# EAGLE design schematic_v2 (EAGLE 6.4)
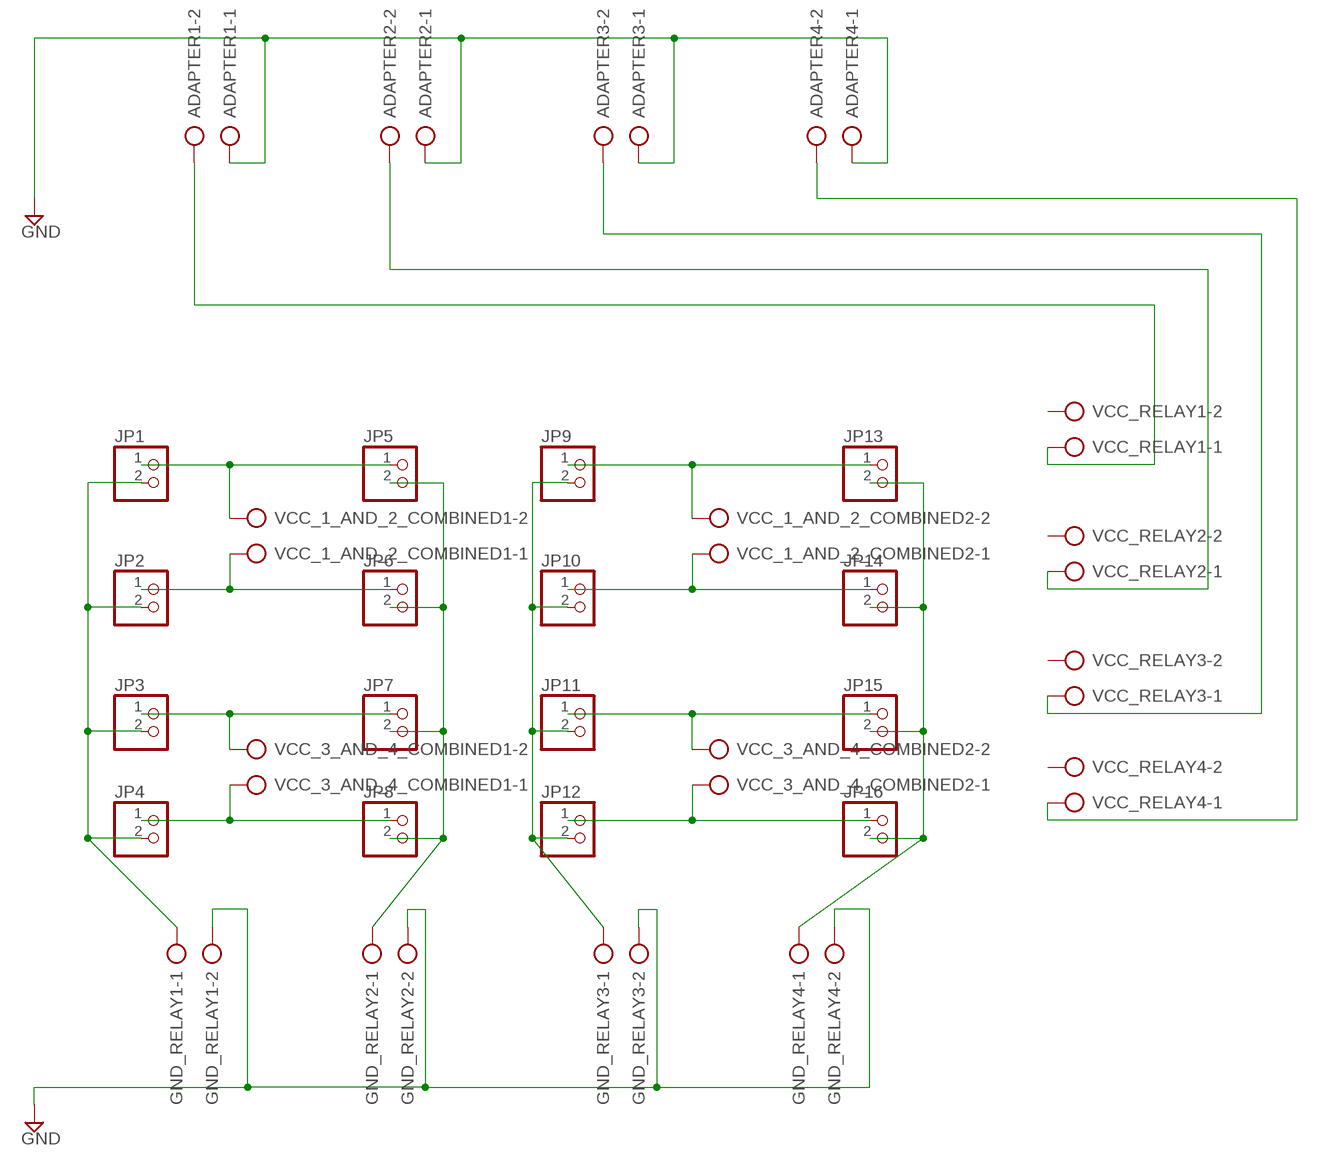
[diagram p0: schematic, sheet 1]

## Parts
ADAPTER1  AK300/2  [AK300/2]
ADAPTER2  AK300/2  [AK300/2]
ADAPTER3  AK300/2  [AK300/2]
ADAPTER4  AK300/2  [AK300/2]
GND_RELAY1  AK300/2  [AK300/2]
GND_RELAY2  AK300/2  [AK300/2]
GND_RELAY3  AK300/2  [AK300/2]
GND_RELAY4  AK300/2  [AK300/2]
JP1  PINHD-1X2  [1X02]
JP2  PINHD-1X2  [1X02]
JP3  PINHD-1X2  [1X02]
JP4  PINHD-1X2  [1X02]
JP5  PINHD-1X2  [1X02]
JP6  PINHD-1X2  [1X02]
JP7  PINHD-1X2  [1X02]
JP8  PINHD-1X2  [1X02]
JP9  PINHD-1X2  [1X02]
JP10  PINHD-1X2  [1X02]
JP11  PINHD-1X2  [1X02]
JP12  PINHD-1X2  [1X02]
JP13  PINHD-1X2  [1X02]
JP14  PINHD-1X2  [1X02]
JP15  PINHD-1X2  [1X02]
JP16  PINHD-1X2  [1X02]
VCC_1_AND_2_COMBINED1  AK300/2  [AK300/2]
VCC_1_AND_2_COMBINED2  AK300/2  [AK300/2]
VCC_3_AND_4_COMBINED1  AK300/2  [AK300/2]
VCC_3_AND_4_COMBINED2  AK300/2  [AK300/2]
VCC_RELAY1  AK300/2  [AK300/2]
VCC_RELAY2  AK300/2  [AK300/2]
VCC_RELAY3  AK300/2  [AK300/2]
VCC_RELAY4  AK300/2  [AK300/2]

## Nets
GND: ADAPTER1.1 ADAPTER2.1 ADAPTER3.1 ADAPTER4.1 GND_RELAY1.2 GND_RELAY2.2 GND_RELAY3.2 GND_RELAY4.2
N$1: JP1.1 JP5.1 VCC_1_AND_2_COMBINED1.2
N$2: JP2.1 JP6.1 VCC_1_AND_2_COMBINED1.1
N$3: JP3.1 JP7.1 VCC_3_AND_4_COMBINED1.2
N$4: JP4.1 JP8.1 VCC_3_AND_4_COMBINED1.1
N$5: ADAPTER1.2 VCC_RELAY1.1
N$6: ADAPTER4.2 VCC_RELAY4.1
N$7: GND_RELAY1.1 JP1.2 JP2.2 JP3.2 JP4.2
N$8: GND_RELAY2.1 JP5.2 JP6.2 JP7.2 JP8.2
N$9: GND_RELAY3.1 JP9.2 JP10.2 JP11.2 JP12.2
N$10: GND_RELAY4.1 JP13.2 JP14.2 JP15.2 JP16.2
N$11: ADAPTER3.2 VCC_RELAY3.1
N$12: ADAPTER2.2 VCC_RELAY2.1
N$13: JP9.1 JP13.1 VCC_1_AND_2_COMBINED2.2
N$14: JP10.1 JP14.1 VCC_1_AND_2_COMBINED2.1
N$15: JP11.1 JP15.1 VCC_3_AND_4_COMBINED2.2
N$16: JP12.1 JP16.1 VCC_3_AND_4_COMBINED2.1
Unconnected: VCC_RELAY1.2 VCC_RELAY2.2 VCC_RELAY3.2 VCC_RELAY4.2

## Library data of the parts
ADAPTER1-ADAPTER4 GND_RELAY1-GND_RELAY4 VCC_1_AND_2_COMBINED1 VCC_1_AND_2_COMBINED2 VCC_3_AND_4_COMBINED1 VCC_3_AND_4_COMBINED2 VCC_RELAY1-VCC_RELAY4 = con-ptr500:AK300/2: CONNECTOR; OC_FARNELL: unknown; OC_NEWARK: unknown
JP1-JP16 = pinhead:PINHD-1X2: PIN HEADER

## Board
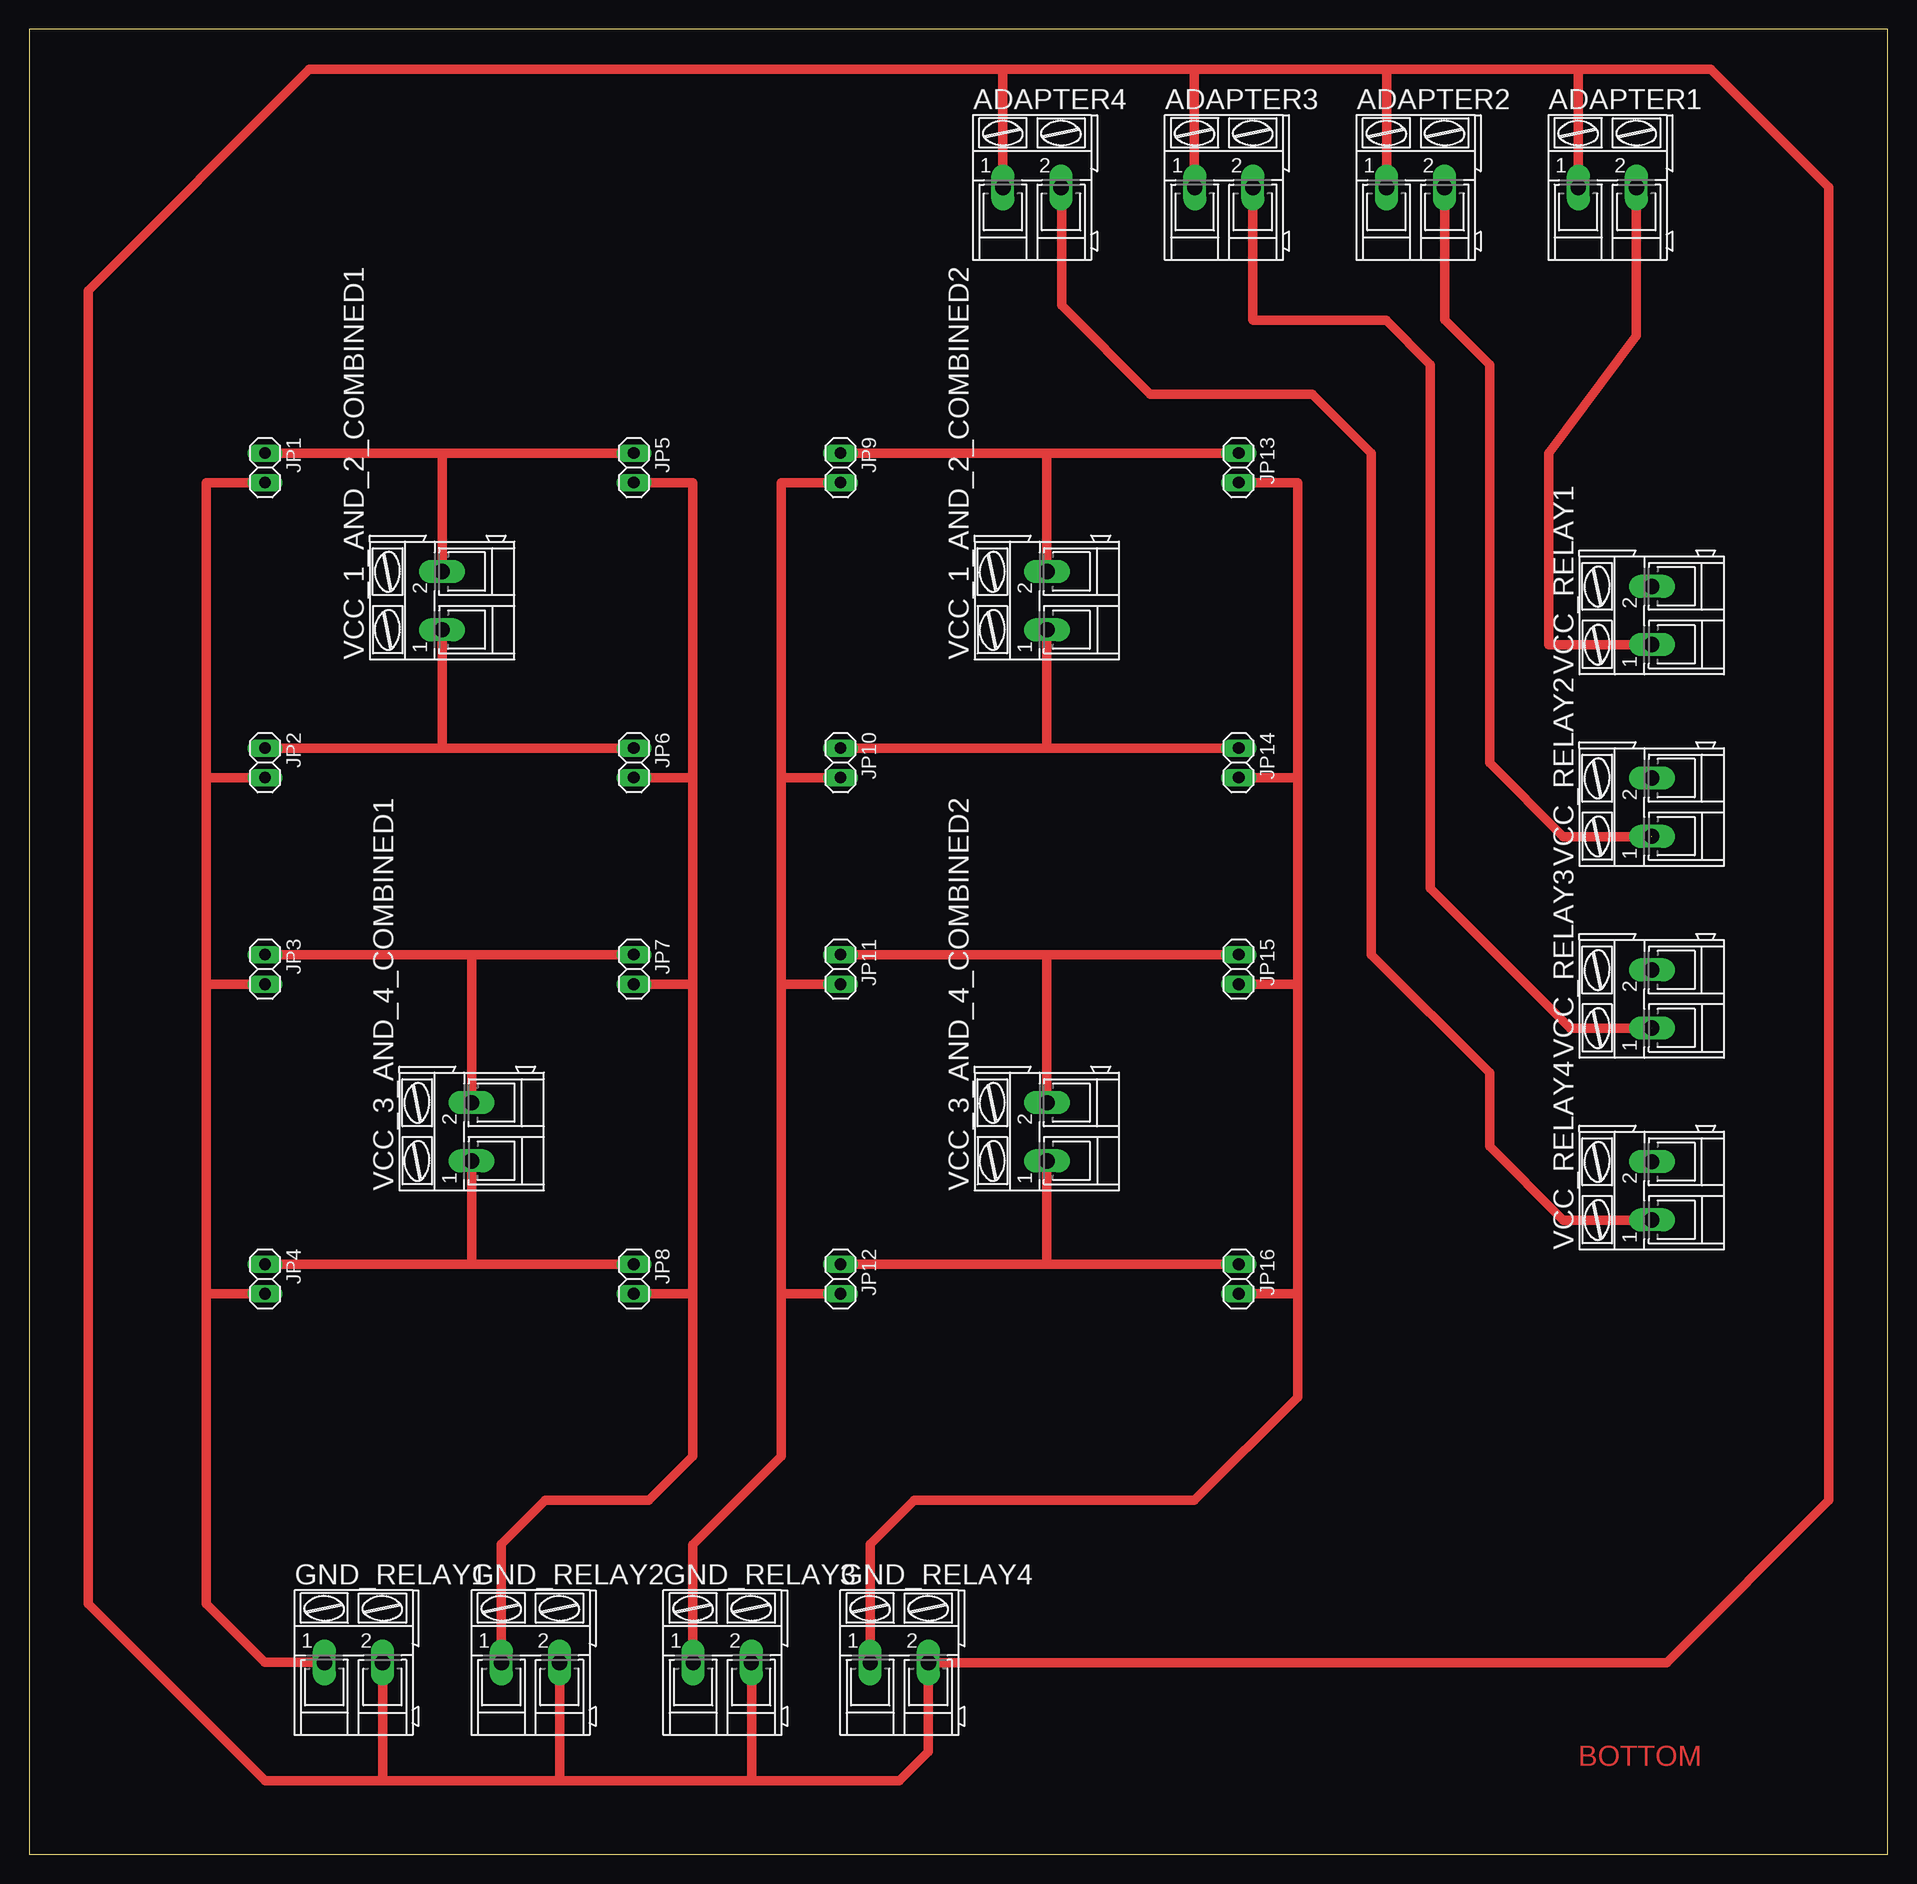
[diagram p1: board, top side]

Size 160 x 157.15 mm. Coordinates in mm from the lower left corner, seen from the top.
Outline: 0,0 160,0 160,157.15 0,157.15 0,0
Copper layers (1*16): Top 0.035mm / dielectric 1.5mm / Bottom 0.035mm
Design rules "default": minimum track width 10mil, minimum drill 24mil, track to track 8mil, track to pad 8mil, pad to pad 8mil, via to via 8mil, smd to smd 8mil, copper to edge 40mil, drill to drill 8mil, minimum pad ring 10mil, minimum via ring 8mil, stop-mask expansion 4mil, vias tented up to drill 0mil, thermal gap 10mil

### Footprints (pad centres in the part's own frame; a part is rotated, then mirrored left to right if it is on the bottom)
AK300/2 = drill 1.321 long: 1 -2.515,0; 2 2.489,0
1X02 = drill 1.016 long: 1 -1.27,0; 2 1.27,0

### Placement (x,y rotation side)
ADAPTER1  135.89,143.51 0 top
ADAPTER2  119.38,143.51 0 top
ADAPTER3  102.87,143.51 0 top
ADAPTER4  86.36,143.51 0 top
GND_RELAY1  27.94,16.51 0 top
GND_RELAY2  43.18,16.51 0 top
GND_RELAY3  59.69,16.51 0 top
GND_RELAY4  74.93,16.51 0 top
JP1  20.32,119.38 270 top
JP2  20.32,93.98 270 top
JP3  20.32,76.2 270 top
JP4  20.32,49.53 270 top
JP5  52.07,119.38 270 top
JP6  52.07,93.98 270 top
JP7  52.07,76.2 270 top
JP8  52.07,49.53 270 top
JP9  69.85,119.38 270 top
JP10  69.85,93.98 270 top
JP11  69.85,76.2 270 top
JP12  69.85,49.53 270 top
JP13  104.14,119.38 270 top
JP14  104.14,93.98 270 top
JP15  104.14,76.2 270 top
JP16  104.14,49.53 270 top
VCC_1_AND_2_COMBINED1  35.56,107.95 90 top
VCC_1_AND_2_COMBINED2  87.63,107.95 90 top
VCC_3_AND_4_COMBINED1  38.1,62.23 90 top
VCC_3_AND_4_COMBINED2  87.63,62.23 90 top
VCC_RELAY1  139.7,106.68 90 top
VCC_RELAY2  139.7,90.17 90 top
VCC_RELAY3  139.7,73.66 90 top
VCC_RELAY4  139.7,57.15 90 top

### Tracks (layer width: path | path; a pad name or v marks a point on that pad's centre or on a via)
GND
  Top 0.813: GND_RELAY4.2 77.42,8.84 74.93,6.35 62.23,6.35 | 62.23,6.35 62.23,16.46 GND_RELAY3.2 | GND_RELAY2.2 45.67,6.4 45.72,6.35 | 45.72,6.35 62.23,6.35 | GND_RELAY1.2 30.43,6.4 | 30.43,6.4 30.48,6.35 45.72,6.35 | 30.43,6.4 30.38,6.35 20.32,6.35 5.08,21.59 5.08,134.62 24.13,153.67 83.82,153.67 | ADAPTER4.1 83.84,153.65 83.82,153.67 | 83.82,153.67 100.33,153.67 | 100.33,153.67 100.33,143.53 ADAPTER3.1 | ADAPTER2.1 116.86,153.65 | 116.86,153.65 116.84,153.67 100.33,153.67 | ADAPTER1.1 133.38,153.65 133.35,153.67 | 133.35,153.67 116.89,153.67 116.86,153.65 | 133.35,143.51 133.35,153.67 | 133.35,153.67 144.78,153.67 154.94,143.51 154.94,30.48 140.97,16.51 77.47,16.51
N$1
  Top 0.813: JP1.1 35.56,120.65 | 35.56,120.65 VCC_1_AND_2_COMBINED1.2 | JP5.1 35.56,120.65
N$2
  Top 0.813: JP2.1 35.56,95.25 | 35.56,95.25 VCC_1_AND_2_COMBINED1.1 | JP6.1 35.56,95.25
N$3
  Top 0.813: JP3.1 38.1,77.47 | 38.1,77.47 VCC_3_AND_4_COMBINED1.2 | JP7.1 38.1,77.47
N$4
  Top 0.813: JP4.1 38.1,50.8 | 38.1,50.8 VCC_3_AND_4_COMBINED1.1 | JP8.1 38.1,50.8
N$5
  Top 0.813: ADAPTER1.2 138.38,130.76 130.81,120.65 130.81,104.14 139.68,104.14 VCC_RELAY1.1
N$6
  Top 0.813: ADAPTER4.2 88.9,143.46 88.9,133.35 96.52,125.73 110.49,125.73 115.57,120.65 115.57,77.47 125.73,67.31 125.73,60.96 132.08,54.61 139.68,54.61 VCC_RELAY4.1
N$7
  Top 0.813: JP1.2 15.24,118.11 15.24,92.71 | 15.24,92.71 JP2.2 | JP3.2 15.24,74.93 | 15.24,74.93 15.24,92.71 | JP4.2 15.24,48.26 | 15.24,48.26 15.24,74.93 | GND_RELAY1.1 25.4,16.54 20.3,16.54 15.24,21.59 15.24,48.26
N$8
  Top 0.813: JP5.2 57.15,118.11 57.15,92.71 | 57.15,92.71 JP6.2 | JP7.2 57.15,74.93 | 57.15,74.93 57.15,92.71 | JP8.2 57.15,48.26 | 57.15,48.26 57.15,49.53 57.15,74.93 | 40.64,16.54 GND_RELAY2.1 40.66,26.7 44.45,30.48 53.34,30.48 57.15,34.29 57.15,48.26
N$9
  Top 0.813: JP9.2 64.77,118.11 64.77,92.71 | 64.77,92.71 JP10.2 | JP11.2 64.77,74.93 | 64.77,74.93 64.77,92.71 | JP12.2 64.77,48.26 | 64.77,48.26 64.77,74.93 | GND_RELAY3.1 57.15,16.54 57.15,26.67 64.77,34.29 64.77,48.26
N$10
  Top 0.813: JP13.2 109.22,118.11 109.22,92.71 | 109.22,92.71 JP14.2 | JP15.2 109.22,74.93 | 109.22,74.93 109.22,92.71 | JP16.2 109.22,48.26 | 109.22,48.26 109.22,74.93 | 72.39,16.54 GND_RELAY4.1 72.42,26.7 76.2,30.48 100.33,30.48 109.22,39.37 109.22,48.26
N$11  (1 unrouted)
  Top 0.813: ADAPTER3.2 105.36,132.13 105.41,132.08 116.84,132.08 120.65,128.27 120.65,83.17 132.7,71.12 139.7,71.12
N$12  (1 unrouted)
  Top 0.813: ADAPTER2.2 121.87,132.13 125.73,128.27 125.73,93.98 132.08,87.63 139.7,87.63
N$13
  Top 0.813: JP9.1 87.63,120.65 | 87.63,120.65 VCC_1_AND_2_COMBINED2.2 | JP13.1 87.63,120.65
N$14
  Top 0.813: JP10.1 87.63,95.25 | 87.63,95.25 VCC_1_AND_2_COMBINED2.1 | JP14.1 87.63,95.25
N$15
  Top 0.813: JP11.1 87.63,77.47 | 87.63,77.47 VCC_3_AND_4_COMBINED2.2 | JP15.1 87.63,77.47
N$16
  Top 0.813: JP12.1 87.63,50.8 | 87.63,50.8 VCC_3_AND_4_COMBINED2.1 | JP16.1 87.63,50.8

### Text on the board
Top: BOTTOM